# EAGLE design Orthrus_3_0_1 (EAGLE 7.6.0)

## Sheet 1 of 2
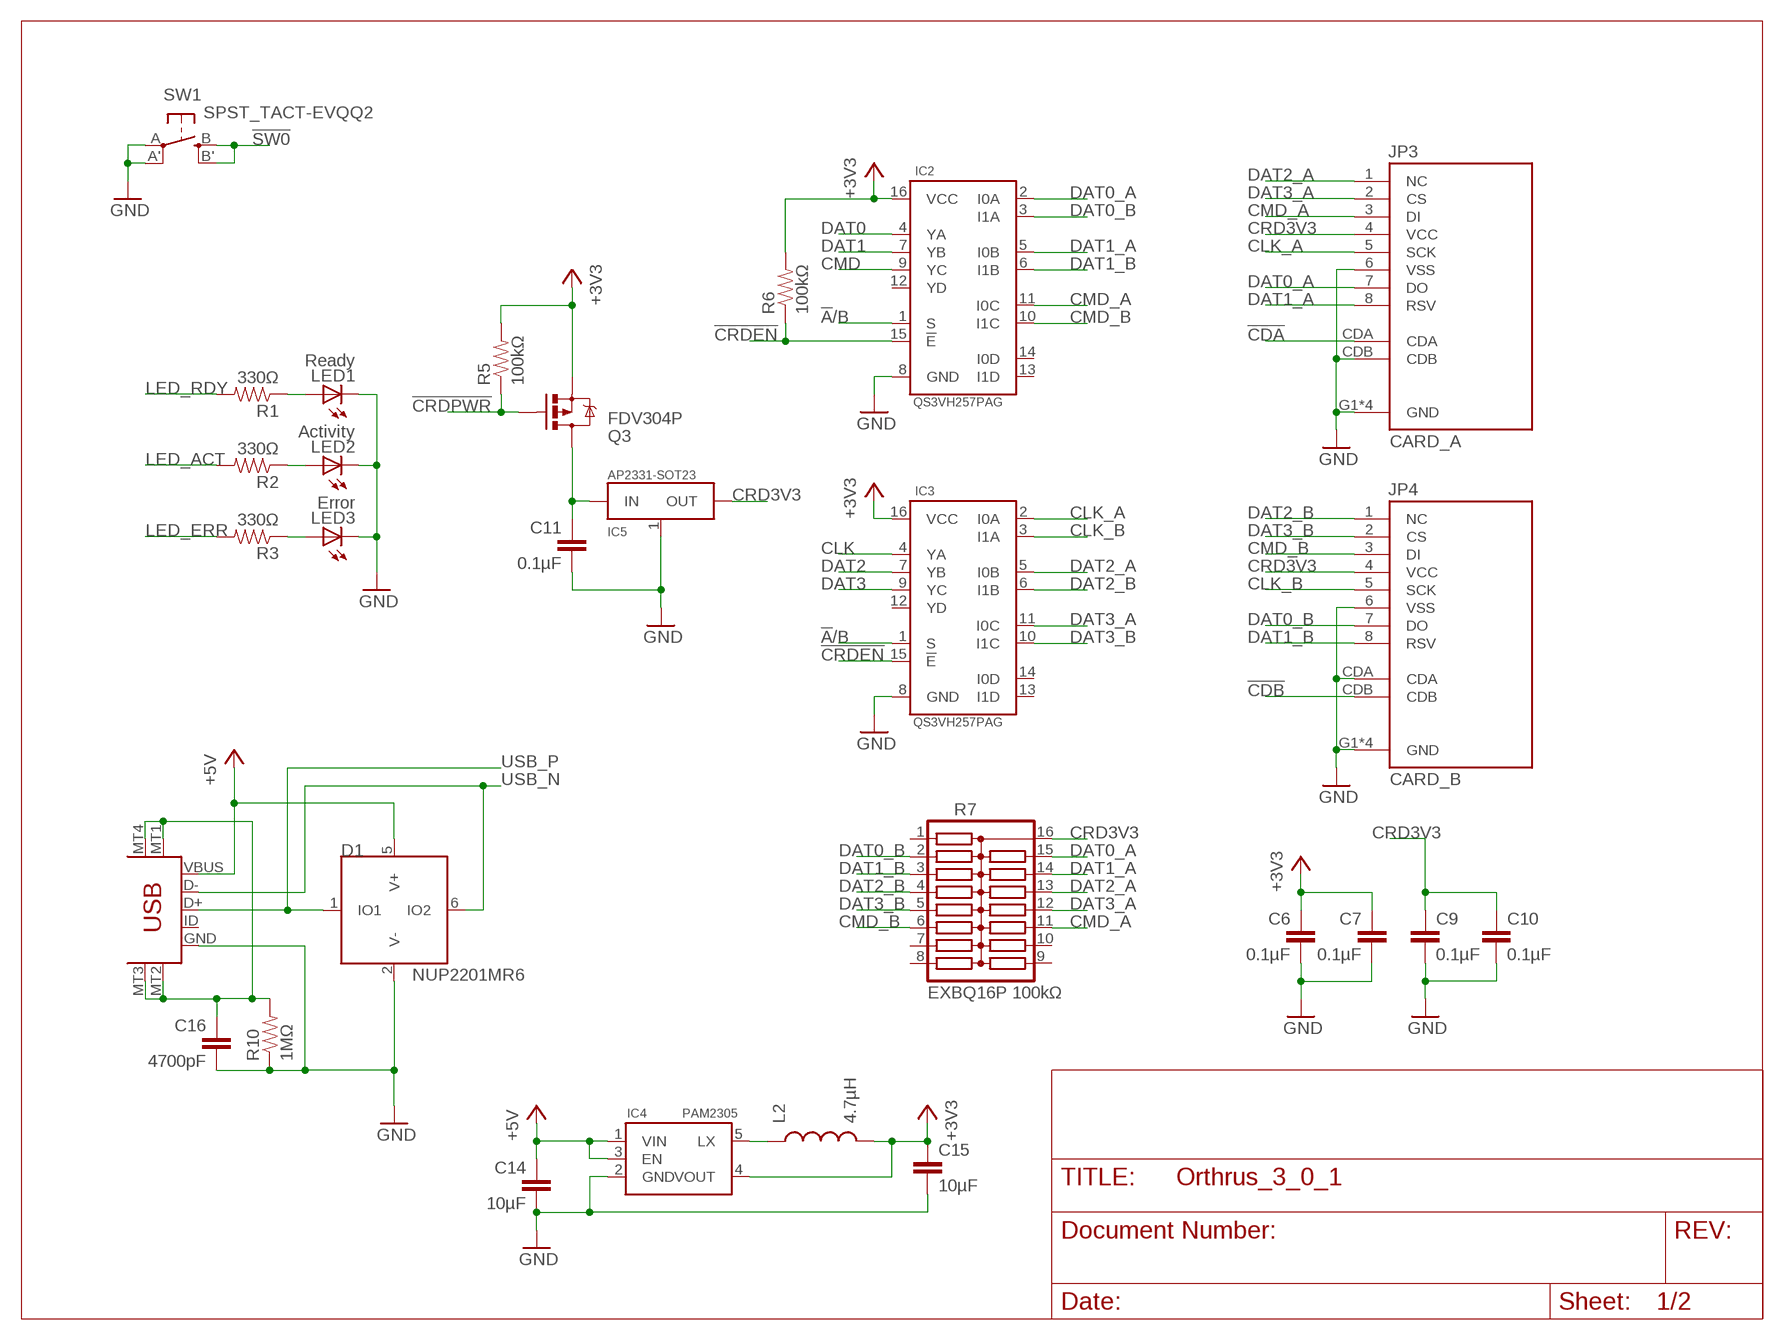
[diagram p0: schematic, sheet 1]

### Parts
C6  0.1µF  CAP0805  [0805]
C7  0.1µF  CAP0805  [0805]
C9  0.1µF  CAP0805  [0805]
C10  0.1µF  CAP0805  [0805]
C11  0.1µF  CAP0805  [0805]
C14  10µF  CAP0805  [0805]
C15  10µF  CAP0805  [0805]
C16  4700pF  CAP0805  [0805]
D1  NUP2201MR6  [SOT23-6]
IC2  QS3VH257PAG  [TSSOP16]
IC3  QS3VH257PAG  [TSSOP16]
IC4  PAM2305  SC189XSKTRTSC189XSKTRT  [SOT23-5]
IC5  AP2331-SOT23  [SOT23-3]
JP1  USB-5PIN-MICROB  [USB-MICROB]
JP3  CARD_A  DM3D-SF  [DM3D-SF]
JP4  CARD_B  DM3D-SF  [DM3D-SF]
L2  4.7µH  INDUCTOR0805  [0805]
LED1  Ready  LEDCHIP-LED0805  [CHIP-LED0805]
LED2  Activity  LEDCHIP-LED0805  [CHIP-LED0805]
LED3  Error  LEDCHIP-LED0805  [CHIP-LED0805]
Q3  FDV304P  MOSFET-PCHANNELSMD  [SOT23-3]
R1  330Ω  RESISTOR0805-RES  [0805]
R2  330Ω  RESISTOR0805-RES  [0805]
R3  330Ω  RESISTOR0805-RES  [0805]
R5  100kΩ  RESISTOR0805-RES  [0805]
R6  100kΩ  RESISTOR0805-RES  [0805]
R7  EXBQ16P 100kΩ  4816P-T02  [4816P]
R10  1MΩ  RESISTOR0805-RES  [0805]
SW1  SPST_TACT-EVQQ2  [EVQ-Q2]

### Nets
!A!/B: IC2.1(S) IC3.1(S) ; also sheet 2
!CDA: JP3.CDA ; also sheet 2
!CDB: JP4.CDB ; also sheet 2
!CRDEN: IC2.15(!E) IC3.15(!E) R6.1 ; also sheet 2
!CRDPWR: Q3.1(G) R5.1 ; also sheet 2
!SW0: SW1.B'(S1) SW1.B(S) ; also sheet 2
+3V3: C6.1 C7.1 C15.1 IC2.16(VCC) IC3.16(VCC) IC4.4(VOUT) L2.2 Q3.2(S) R5.2 R6.2 ; also sheet 2
+5V: C14.1 D1.5(V+) IC4.1(VIN) IC4.3(EN) JP1.VBUS
CLK: IC3.4(YA) ; also sheet 2
CLK_A: IC3.2(I0A) JP3.5(SCK)
CLK_B: IC3.3(I1A) JP4.5(SCK)
CMD: IC2.9(YC) ; also sheet 2
CMD_A: IC2.11(I0C) JP3.3(DI) R7.11
CMD_B: IC2.10(I1C) JP4.3(DI) R7.6
CRD3V3: C9.1 C10.1 IC5.2(OUT) JP3.4(VCC) JP4.4(VCC) R7.16
DAT0: IC2.4(YA) ; also sheet 2
DAT0_A: IC2.2(I0A) JP3.7(DO) R7.15
DAT0_B: IC2.3(I1A) JP4.7(DO) R7.2
DAT1: IC2.7(YB) ; also sheet 2
DAT1_A: IC2.5(I0B) JP3.8(RSV) R7.14
DAT1_B: IC2.6(I1B) JP4.8(RSV) R7.3
DAT2: IC3.7(YB) ; also sheet 2
DAT2_A: IC3.5(I0B) JP3.1(NC) R7.13
DAT2_B: IC3.6(I1B) JP4.1(NC) R7.4
DAT3: IC3.9(YC) ; also sheet 2
DAT3_A: IC3.11(I0C) JP3.2(CS) R7.12
DAT3_B: IC3.10(I1C) JP4.2(CS) R7.5
GND: C6.2 C7.2 C9.2 C10.2 C11.2 C14.2 C15.2 C16.2 D1.2(V-) IC2.8(GND) IC3.8(GND) IC4.2(GND) IC5.1(GND) JP1.GND JP3.6(VSS) JP3.CDB JP3.G1(GND) JP3.G2(GND) JP3.G3(GND) JP3.G4(GND) JP4.6(VSS) JP4.CDA JP4.G1(GND) JP4.G2(GND) JP4.G3(GND) JP4.G4(GND) LED1.C LED2.C LED3.C R10.1 SW1.A'(P1) SW1.A(P) ; also sheet 2
LED_ACT: R2.2 ; also sheet 2
LED_ERR: R3.2 ; also sheet 2
LED_RDY: R1.2 ; also sheet 2
N$1: IC4.5(LX) L2.1
N$2: C11.1 IC5.3(IN) Q3.3(D)
N$4: C16.1 JP1.MT1(MTN1) JP1.MT2(MTN3) JP1.MT3(MTN4) JP1.MT4(MTN2) R10.2
N$14: LED3.A R3.1
N$15: LED2.A R2.1
N$16: LED1.A R1.1
USB_N [diff pair]: D1.6(IO2) JP1.D- ; also sheet 2
USB_P [diff pair]: D1.1(IO1) JP1.D+ ; also sheet 2
Unconnected: IC2.12(YD) IC2.13(I1D) IC2.14(I0D) IC3.12(YD) IC3.13(I1D) IC3.14(I0D) JP1.ID R7.1 R7.7 R7.8 R7.9 R7.10

## Sheet 2 of 2
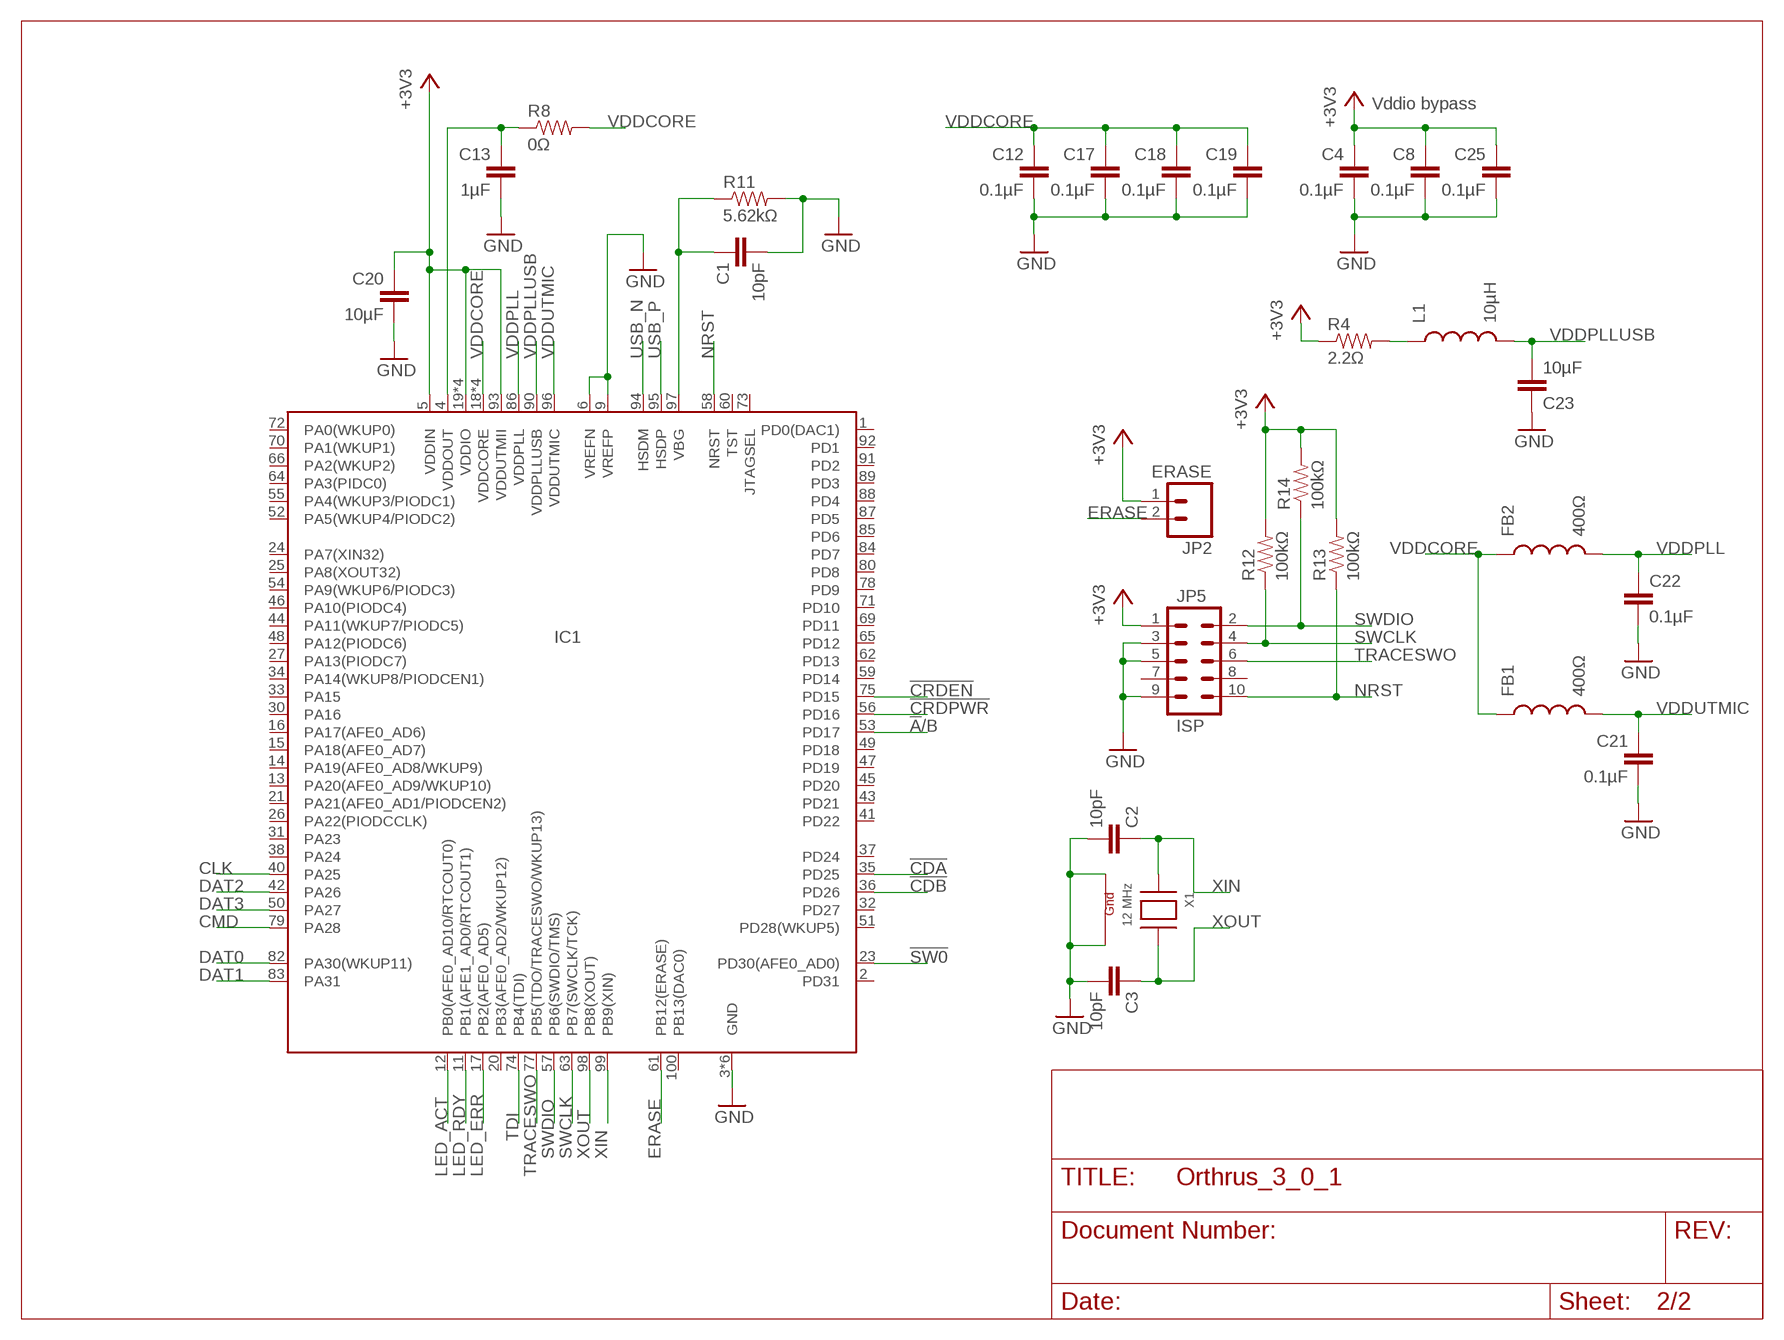
[diagram p1: schematic, sheet 2]

### Parts
C1  10pF  CAP0805  [0805]
C2  10pF  CAP0805  [0805]
C3  10pF  CAP0805  [0805]
C4  0.1µF  CAP0805  [0805]
C8  0.1µF  CAP0805  [0805]
C12  0.1µF  CAP0805  [0805]
C13  1µF  CAP0805  [0805]
C17  0.1µF  CAP0805  [0805]
C18  0.1µF  CAP0805  [0805]
C19  0.1µF  CAP0805  [0805]
C20  10µF  CAP0805  [0805]
C21  0.1µF  CAP0805  [0805]
C22  0.1µF  CAP0805  [0805]
C23  10µF  CAP0805  [0805]
C25  0.1µF  CAP0805  [0805]
FB1  400Ω  INDUCTOR0805  [0805]
FB2  400Ω  INDUCTOR0805  [0805]
IC1  ATSAMS70NXXAN  [TQFP100]
JP2  ERASE  M02PTH  [1X02]
JP5  ISP  M05X250MIL  [JTAGICE3-50MIL]
L1  10µH  INDUCTOR0805  [0805]
R4  2.2Ω  RESISTOR0805-RES  [0805]
R8  0Ω  RESISTOR0805-WITH-JUMPER  [0805-WITH-JUMPER]
R11  5.62kΩ  RESISTOR0805-RES  [0805]
R12  100kΩ  RESISTOR0805-RES  [0805]
R13  100kΩ  RESISTOR0805-RES  [0805]
R14  100kΩ  RESISTOR0805-RES  [0805]
X1  12 MHz  XTAL-4-3225  [NX3225]

### Nets
!A!/B: IC1.53(PD17) ; also sheet 1
!CDA: IC1.35(PD25) ; also sheet 1
!CDB: IC1.36(PD26) ; also sheet 1
!CRDEN: IC1.75(PD15) ; also sheet 1
!CRDPWR: IC1.56(PD16) ; also sheet 1
!SW0: IC1.23(PD30(AFE0_AD0)) ; also sheet 1
+3V3: C4.1 C8.1 C20.1 C25.1 IC1.5(VDDIN) IC1.19(VDDIO) IC1.28(VDDIO) IC1.68(VDDIO) IC1.81(VDDIO) IC1.93(VDDUTMII) JP2.1 JP5.1 R4.1 R12.2 R13.2 R14.2 ; also sheet 1
CLK: IC1.40(PA25) ; also sheet 1
CMD: IC1.79(PA28) ; also sheet 1
DAT0: IC1.82(PA30(WKUP11)) ; also sheet 1
DAT1: IC1.83(PA31) ; also sheet 1
DAT2: IC1.42(PA26) ; also sheet 1
DAT3: IC1.50(PA27) ; also sheet 1
ERASE: IC1.61(PB12(ERASE)) JP2.2
GND: C1.2 C2.2 C3.2 C4.2 C8.2 C12.2 C13.2 C17.2 C18.2 C19.2 C20.2 C21.2 C22.2 C23.1 C25.2 IC1.3(GND) IC1.6(VREFN) IC1.7(GND) IC1.8(GND) IC1.9(VREFP) IC1.10(GND) IC1.29(GND) IC1.67(GND) JP5.3 JP5.5 JP5.9 R11.2 X1.2(G2) X1.4(G1) ; also sheet 1
LED_ACT: IC1.12(PB0(AFE0_AD10/RTCOUT0)) ; also sheet 1
LED_ERR: IC1.17(PB2(AFE0_AD5)) ; also sheet 1
LED_RDY: IC1.11(PB1(AFE1_AD0/RTCOUT1)) ; also sheet 1
N$3: C1.1 IC1.97(VBG) R11.1
N$5: L1.1 R4.2
N$6: C13.1 IC1.4(VDDOUT) R8.1
NRST: IC1.58(NRST) JP5.10 R13.1
SWCLK: IC1.63(PB7(SWCLK/TCK)) JP5.4 R12.1
SWDIO: IC1.57(PB6(SWDIO/TMS)) JP5.2 R14.1
TDI: IC1.74(PB4(TDI))
TRACESWO: IC1.77(PB5(TDO/TRACESWO/WKUP13)) JP5.6
USB_N [diff pair]: IC1.94(HSDM) ; also sheet 1
USB_P [diff pair]: IC1.95(HSDP) ; also sheet 1
VDDCORE: C12.1 C17.1 C18.1 C19.1 FB1.1 FB2.1 IC1.18(VDDCORE) IC1.22(VDDCORE) IC1.39(VDDCORE) IC1.76(VDDCORE) R8.2
VDDPLL: C22.1 FB2.2 IC1.86(VDDPLL)
VDDPLLUSB: C23.2 IC1.90(VDDPLLUSB) L1.2
VDDUTMIC: C21.1 FB1.2 IC1.96(VDDUTMIC)
XIN: C2.1 IC1.99(PB9(XIN)) X1.1(X1)
XOUT: C3.1 IC1.98(PB8(XOUT)) X1.3(X2)
Unconnected: IC1.1(PD0(DAC1)) IC1.2(PD31) IC1.13(PA20(AFE0_AD9/WKUP10)) IC1.14(PA19(AFE0_AD8/WKUP9)) IC1.15(PA18(AFE0_AD7)) IC1.16(PA17(AFE0_AD6)) IC1.20(PB3(AFE0_AD2/WKUP12)) IC1.21(PA21(AFE0_AD1/PIODCEN2)) IC1.24(PA7(XIN32)) IC1.25(PA8(XOUT32)) IC1.26(PA22(PIODCCLK)) IC1.27(PA13(PIODC7)) IC1.30(PA16) IC1.31(PA23) IC1.32(PD27) IC1.33(PA15) IC1.34(PA14(WKUP8/PIODCEN1)) IC1.37(PD24) IC1.38(PA24) IC1.41(PD22) IC1.43(PD21) IC1.44(PA11(WKUP7/PIODC5)) IC1.45(PD20) IC1.46(PA10(PIODC4)) IC1.47(PD19) IC1.48(PA12(PIODC6)) IC1.49(PD18) IC1.51(PD28(WKUP5)) IC1.52(PA5(WKUP4/PIODC2)) IC1.54(PA9(WKUP6/PIODC3)) IC1.55(PA4(WKUP3/PIODC1)) IC1.59(PD14) IC1.60(TST) IC1.62(PD13) IC1.64(PA3(PIDC0)) IC1.65(PD12) IC1.66(PA2(WKUP2)) IC1.69(PD11) IC1.70(PA1(WKUP1)) IC1.71(PD10) IC1.72(PA0(WKUP0)) IC1.73(JTAGSEL) IC1.78(PD9) IC1.80(PD8) IC1.84(PD7) IC1.85(PD6) IC1.87(PD5) IC1.88(PD4) IC1.89(PD3) IC1.91(PD2) IC1.92(PD1) IC1.100(PB13(DAC0)) JP5.7 JP5.8

### Notes on the sheet
- Vddio bypass

## Library data of the parts
C1-C4 C6-C23 C25 = SparkFun-Capacitors:CAP: Capacitor Standard 0603 ceramic capacitor, and 0.1" leaded capacitor.
D1 = AP2331:NUP2201MR6
FB1 FB2 L1 L2 = SparkFun-Passives:INDUCTOR: Inductors Basic Inductor/Choke - 0603 and 1206. Footprints are not proven and vary greatly between part numbers. SRN6045- 33uH, 20% 1.4A
IC1 = avr-7:ATSAMS70NXX
IC2 IC3 = AP2331:QS3VH257
IC4 = regulators:SC189XSKTRT
IC5 = AP2331:AP2331-SOT23
JP1 = SparkFun-Connectors:USB-5PIN: Mini-USB "B" connector with 5th pin broken out. Created new symbol breaking out 5th "ID" pin in mini/micro USB connector spec. See: http://en.wikipedia.org/wiki/Mini_usb#Cables. Uses same footprint as 4-pin symbol. Also added pins to connect to mounting / shield pads if required (probably not generally needed as signals aren't shielded once they leave the connector).
JP2 = SparkFun-Connectors:M02: Standard 2-pin 0.1" header. Use with - straight break away headers ( PRT-00116) - right angle break away headers (PRT-00553) - swiss pins (PRT-00743) - machine pins (PRT-00117) - female headers (PRT-00115) Molex polarized connector foot print use with: PRT-08233 with associated crimp pins and housings. 2.54_SCREWTERM for use with PRT-10571. 3.5mm Screw Terminal footprints for PRT-08084 5mm Screw Terminal footprints for use with PRT-08433
JP3 JP4 = hirose_usd:DM3D-SF
JP5 = SparkFun-Connectors-new:M05X2: Header 5x2 Standard 10-pin dual row 0.1" header. Commonly used with AVR-ISP. Use with Spark Fun Electronics SKU: PRT-00778
LED1-LED3 = adafruit:LED: LED OSRAM: - CHIPLED LG R971, LG N971, LY N971, LG Q971, LY Q971, LO R971, LY R971 LH N974, LH R974 LS Q976, LO Q976, LY Q976 LO Q996 - Hyper CHIPLED LW Q18S LB Q993, LB Q99A, LB R99A - SideLED LS A670, LO A670, LY A670, LG A670, LP A670 LB A673, LV A673, LT A673, LW A673 LH A674 LY A675 LS A676, LA A676, LO A676, LY A676, LW A676 LS A679, LY A679, LG A679 - Hyper Micro SIDELED® LS Y876, LA Y876, LO Y876, LY Y876 LT Y87S - SmartLED LW L88C, LW L88S LB L89C, LB L89S, LG L890 LS L89K, LO L89K, LY L89K LS L896, LA L896, LO L896, LY L896 - TOPLED LS T670, LO T670, LY T670, LG T670, LP T670 LSG T670, LSP T670, LSY T670, LOP T670, LYG T670 LG T671, LOG T671, LSG T671 LB T673, LV T673, LT T673, LW T673 LH T674 LS T676, LA T676, LO T676, LY T676, LB T676, LH T676, LSB T676, LW T676 LB T67C, LV T67C, LT T67C, LS T67K, LO T67K, LY T67K, LW E67C LS E67B, LA E67B, LO E67B, LY E67B, LB E67C, LV E67C, LT E67C LW T67C LS T679, LY T679, LG T679 LS T770, LO T770, LY T770, LG T770, LP T770 LB T773, LV T773, LT T773, LW T773 LH T774 LS E675, LA E675, LY E675, LS T675 LS T776, LA T776, LO T776, LY T776, LB T776 LHGB T686 LT T68C, LB T68C - Hyper Mini TOPLED® LB M676 - Mini TOPLED Santana® LG M470 LS M47K, LO M47K, LY M47K Source: http://www.osram.convergy.de/
Q3 = SparkFun-DiscreteSemi:MOSFET-PCHANNEL: Generic PMOSFET
R1-R6 R8 R10-R14 = SparkFun-Resistors:RESISTOR: Resistor Basic schematic elements and footprints for 0603, 1206, and PTH resistors.
R7 = resistor-bourns copy:4816P-T02: BOURNS RESISTOR NETWORK; MF: BOURNS, INC.; MPN: 4816P-T02-824LF; OC_FARNELL: 9357599; OC_NEWARK: 33K0777
SW1 = adafruit:SPST_TACT: SMT 6mm switch, EVQQ2 series http://www.ladyada.net/library/eagle
X1 = adafruit:XTAL-4: Classic 4-pin 3.2 x 2.5mm crystal

## Net classes
1 diff pair: width 0.152 mm, drill 0.33 mm

## Board
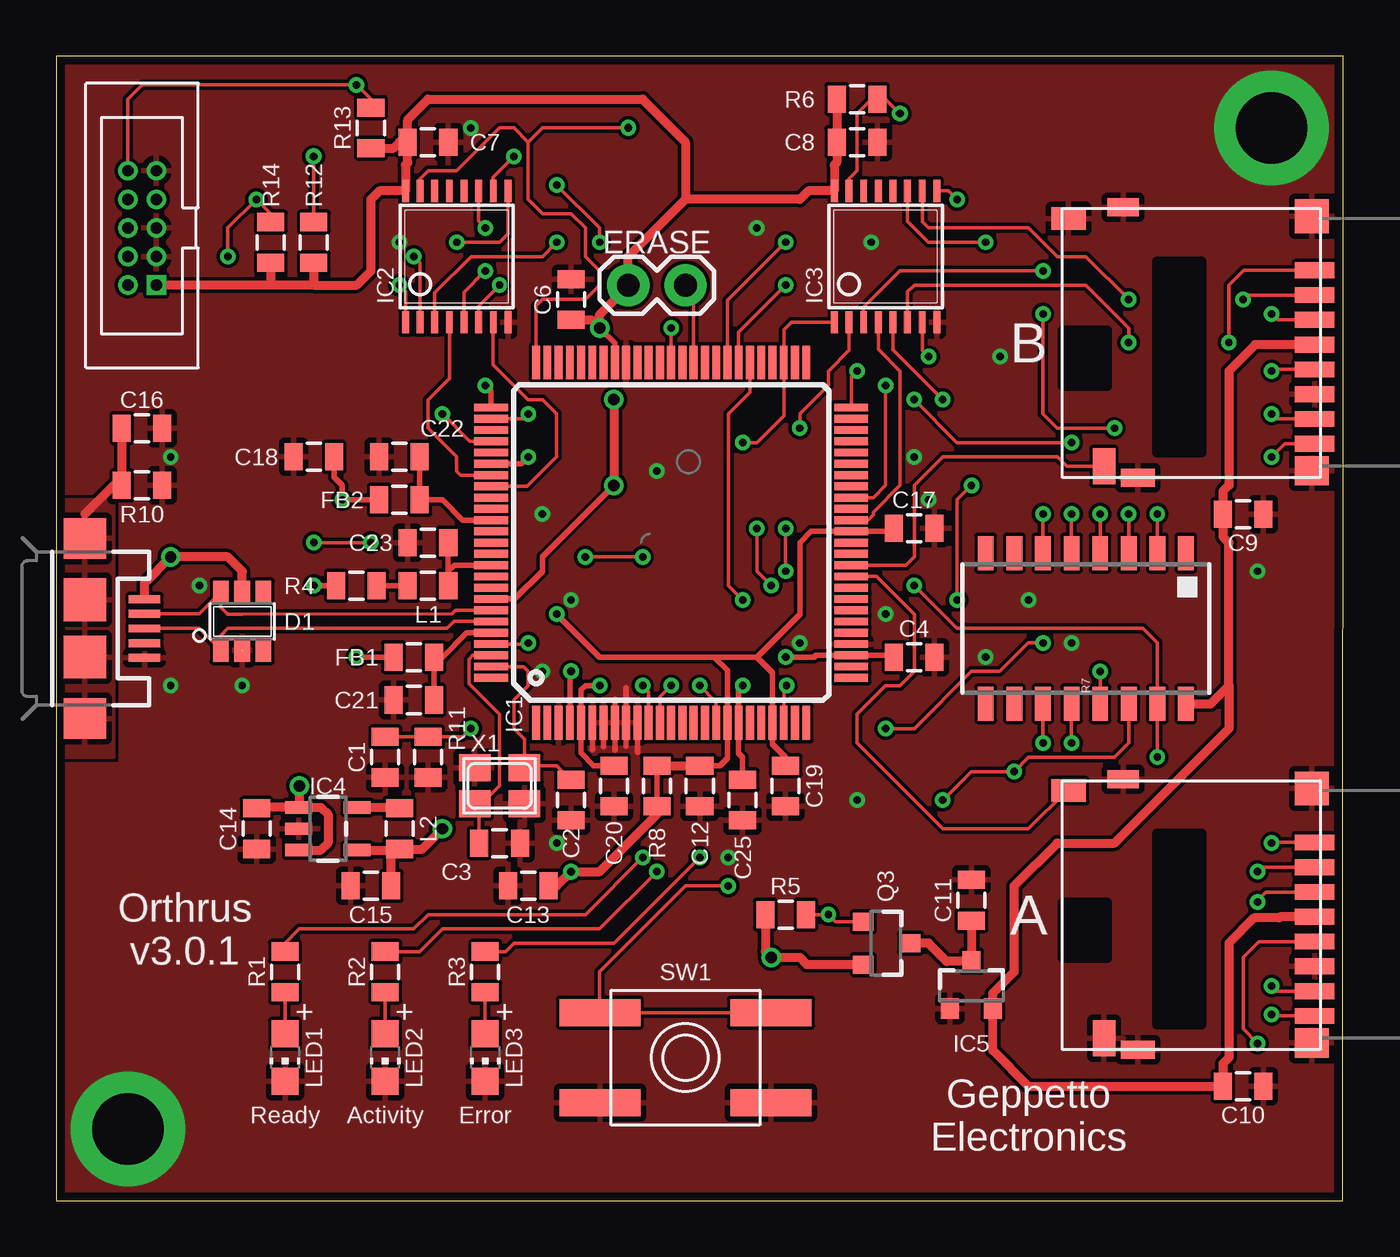
[diagram p2: board, top side]
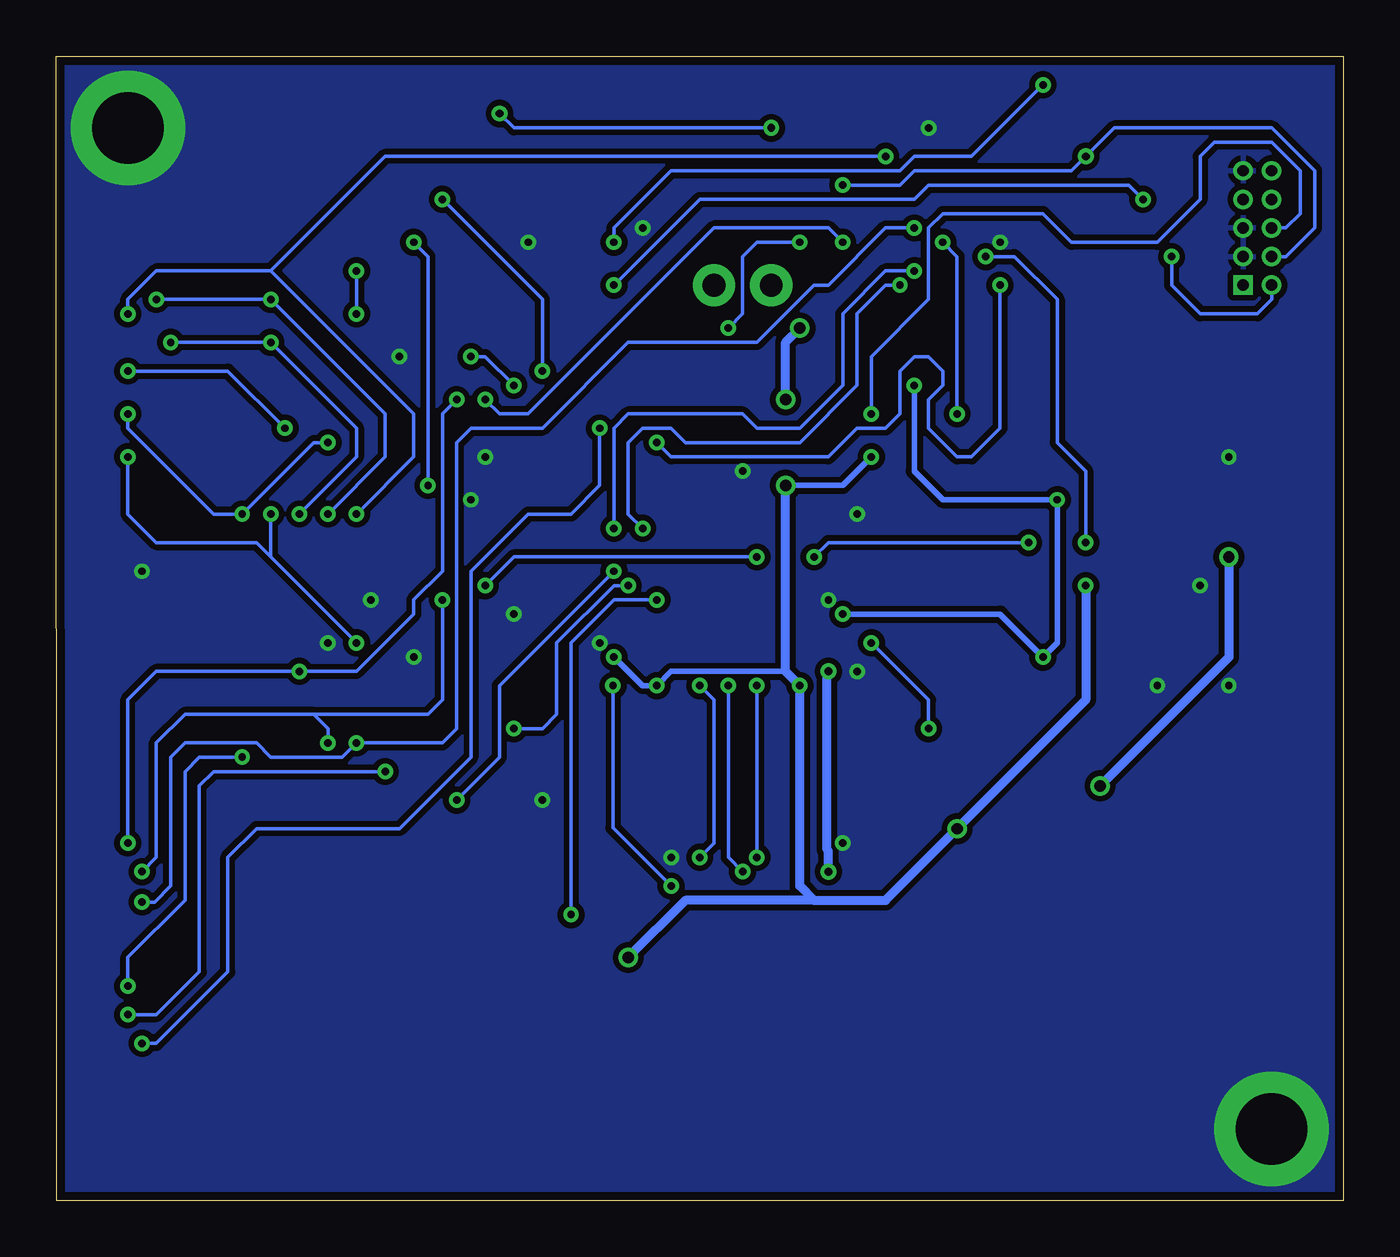
[diagram p3: board, bottom side, seen from below]

Size 57.15 x 50.8 mm. Coordinates in mm from the lower left corner, seen from the top.
Outline: 0,0 57.13,0 57.15,50.8 0,50.8 0,0
Copper layers (1*16): Top 0.0356mm / dielectric 1.5011mm / Bottom 0.0356mm
Design rules "oshpark-2layer *": minimum track width 6mil, minimum drill 13mil, track to track 6mil, track to pad 6mil, pad to pad 6mil, via to via 6mil, smd to smd 6mil, copper to edge 15mil, drill to drill 6mil, minimum pad ring 7mil, minimum via ring 7mil, stop-mask expansion 2.5mil, vias tented up to drill 20mil, thermal gap 10mil

### Footprints (pad centres in the part's own frame; a part is rotated, then mirrored left to right if it is on the bottom)
0805 = smd 0.8 x 1.2: 1 -0.9,0; 2 0.9,0
SOT23-6 = smd 0.69 x 0.99: 1 -0.95,-1.29; 2 0,-1.29; 3 0.95,-1.29; 4 0.95,1.3; 5 0,1.3; 6 -0.95,1.3
TQFP100 = smd 1.5 x 0.35: 1 -8,6; 2 -8,5.5; 3 -8,5; 4 -8,4.5; 5 -8,4; 6 -8,3.5; 7 -8,3; 8 -8,2.5; 9 -8,2; 10 -8,1.5; 11 -8,1; 12 -8,0.5; 13 -8,0; 14 -8,-0.5; 15 -8,-1; 16 -8,-1.5; 17 -8,-2; 18 -8,-2.5; 19 -8,-3; 20 -8,-3.5; 21 -8,-4; 22 -8,-4.5; 23 -8,-5; 24 -8,-5.5; 25 -8,-6; 51 8,-6; 52 8,-5.5; 53 8,-5; 54 8,-4.5; 55 8,-4; 56 8,-3.5; 57 8,-3; 58 8,-2.5; 59 8,-2; 60 8,-1.5; 61 8,-1; 62 8,-0.5; 63 8,0; 64 8,0.5; 65 8,1; 66 8,1.5; 67 8,2; 68 8,2.5; 69 8,3; 70 8,3.5; 71 8,4; 72 8,4.5; 73 8,5; 74 8,5.5; 75 8,6 | smd 0.35 x 1.5: 26 -6,-8; 27 -5.5,-8; 28 -5,-8; 29 -4.5,-8; 30 -4,-8; 31 -3.5,-8; 32 -3,-8; 33 -2.5,-8; 34 -2,-8; 35 -1.5,-8; 36 -1,-8; 37 -0.5,-8; 38 0,-8; 39 0.5,-8; 40 1,-8; 41 1.5,-8; 42 2,-8; 43 2.5,-8; 44 3,-8; 45 3.5,-8; 46 4,-8; 47 4.5,-8; 48 5,-8; 49 5.5,-8; 50 6,-8; 76 6,8; 77 5.5,8; 78 5,8; 79 4.5,8; 80 4,8; 81 3.5,8; 82 3,8; 83 2.5,8; 84 2,8; 85 1.5,8; 86 1,8; 87 0.5,8; 88 0,8; 89 -0.5,8; 90 -1,8; 91 -1.5,8; 92 -2,8; 93 -2.5,8; 94 -3,8; 95 -3.5,8; 96 -4,8; 97 -4.5,8; 98 -5,8; 99 -5.5,8; 100 -6,8
TSSOP16 = smd 0.305 x 0.991: 1 -2.275,-2.918; 2 -1.625,-2.918; 3 -0.975,-2.918; 4 -0.325,-2.918; 5 0.325,-2.918; 6 0.975,-2.918; 7 1.625,-2.918; 8 2.275,-2.918; 9 2.275,2.918; 10 1.625,2.918; 11 0.975,2.918; 12 0.325,2.918; 13 -0.325,2.918; 14 -0.975,2.918; 15 -1.625,2.918; 16 -2.275,2.918
SOT23-5 = smd 0.55 x 1.2: 1 -0.95,-1.3; 2 0,-1.3; 3 0.95,-1.3; 4 0.95,1.3; 5 -0.95,1.3
SOT23-3 = smd 0.8 x 0.9: 1 -0.95,-1; 2 0.95,-1; 3 0,1.1
USB-MICROB = smd 0.35 x 1.4: D+ 0,2.65; D- -0.65,2.65; GND 1.3,2.65; ID 0.65,2.65; VBUS -1.3,2.65 | smd 1.8 x 1.9: MT1 -4,0; MT4 4,0 | smd 1.9 x 1.9: MT2 -1.27,0; MT3 1.27,0
1X02 = drill 1.016 pad 1.88: 1 0,0; 2 2.54,0
DM3D-SF = smd 0.7 x 1.75: 1 3.2,0; 2 2.1,0; 3 1,0; 4 -0.1,0; 5 -1.2,0; 6 -2.3,0; 7 -3.4,0; 8 -4.5,0 | smd 1 x 1.55: CDA 5.5,10.925 | smd 1.6 x 1: CDB -5.5,9.35 | smd 1.3 x 1.5: G1 -5.7,0.125 | smd 1.5 x 1.5: G2 5.6,0.125 | smd 0.8 x 1.5: G3 -6,7.85 | smd 0.8 x 1.4: G4 6,8.5
JTAGICE3-50MIL = drill 0.508 pad 0.813 square: 1 -2.54,-0.635 | drill 0.508 pad 0.813: 2 -2.54,0.635; 3 -1.27,-0.635; 4 -1.27,0.635; 5 0,-0.635; 6 0,0.635; 7 1.27,-0.635; 8 1.27,0.635; 9 2.54,-0.635; 10 2.54,0.635
CHIP-LED0805 = smd 1.2 x 1.2: A 0,-1.05; C 0,1.05
4816P = smd 0.7 x 1.5: 1 -4.445,-3.346; 2 -3.175,-3.346; 3 -1.905,-3.346; 4 -0.635,-3.346; 5 0.635,-3.346; 6 1.905,-3.346; 7 3.175,-3.346; 8 4.445,-3.346; 9 4.445,3.346; 10 3.175,3.346; 11 1.905,3.346; 12 0.635,3.346; 13 -0.635,3.346; 14 -1.905,3.346; 15 -3.175,3.346; 16 -4.445,3.346
0805-WITH-JUMPER = smd 0.8 x 1.2: 1 -0.9,0; 2 0.9,0
EVQ-Q2 = smd 3.6 x 1.2: A -3.8,-2; A' 3.8,-2; B -3.8,2; B' 3.8,2
NX3225 = smd 1.4 x 1.2: 1 -1.1,-0.8; 2 1.1,-0.8; 3 1.1,0.8; 4 -1.1,0.8

### Placement (x,y rotation side)
C1  14.61,19.68 270 top
C2  22.86,17.78 270 top
C3  19.68,15.88 0 top
C4  38.1,24.13 0 top
C6  22.86,40.01 90 top
C7  16.51,46.99 0 top
C8  35.56,46.99 0 top
C9  52.7,30.48 0 top
C10  52.7,5.08 0 top
C11  40.64,13.34 90 top
C12  28.57,18.41 270 top
C13  20.95,13.97 180 top
C14  8.89,16.51 270 top
C15  13.97,13.97 180 top
C16  3.81,34.29 0 top
C17  38.1,29.84 0 top
C18  11.43,33.02 180 top
C19  32.38,18.41 270 top
C20  24.77,18.41 270 top
C21  15.88,22.23 180 top
C22  15.24,33.02 180 top
C23  16.51,29.21 0 top
C25  30.48,17.78 270 top
D1  8.26,25.72 0 top
FB1  15.88,24.13 0 top
FB2  15.24,31.11 0 top
IC1  27.3,29.21 90 top
IC2  17.78,41.91 0 top
IC3  36.83,41.91 0 top
IC4  12.06,16.51 270 top
IC5  40.64,9.53 0 top
JP1  1.27,25.4 270 top
JP2  25.4,40.64 0 top
JP3  55.88,12.7 90 top
JP4  55.88,38.1 90 top
JP5  3.81,43.18 90 top
L1  16.51,27.3 0 top
L2  15.24,16.51 270 top
LED1  10.16,6.35 180 top
LED2  14.61,6.35 180 top
LED3  19.05,6.35 180 top
Q3  36.83,11.43 270 top
R1  10.16,10.16 90 top
R2  14.61,10.16 90 top
R3  19.05,10.16 90 top
R4  13.34,27.3 0 top
R5  32.38,12.7 180 top
R6  35.56,48.9 180 top
R7  45.72,25.4 180 top
R8  26.67,18.41 90 top
R10  3.81,31.75 180 top
R11  16.51,19.68 270 top
R12  11.43,42.55 270 top
R13  13.97,47.62 270 top
R14  9.53,42.55 270 top
SW1  27.94,6.35 0 top
X1  19.68,18.41 180 top

### Tracks (layer width: path | path; a pad name or v marks a point on that pad's centre or on a via)
!A!/B  (via drill 0.33)
  Top 0.152: IC3.1 32.64,38.99 32.3,38.66 IC1.53 32.3,34.84 31.11,33.66 v30.48,33.66 | IC2.1 15.51,40.38 v15.24,40.64
  Bottom 0.152: v15.24,40.64 15.24,34.29 16.51,33.02 17.14,33.02 18.41,34.29 18.41,35.56 17.78,36.2 17.78,36.83 18.41,37.47 19.05,37.47 19.68,36.83 19.68,34.92 20.32,34.29 21.59,34.29 22.86,33.02 29.84,33.02 v30.48,33.66
!CDA
  Top 0.152: JP3.CDA 44.87,18.2 43.18,16.51 39.37,16.51 35.56,20.32 35.56,21.59 36.83,22.86 37.47,22.86 38.1,23.5 38.1,26.04 36.42,27.71 IC1.35
!CDB
  Top 0.152: JP4.CDB 44.87,32.6 44.45,33.02 39.37,33.02 38.1,31.75 38.1,28.57 37.73,28.21 IC1.36
!CRDEN  (via drill 0.35)
  Top 0.152: IC3.15 35.2,45.37 35.56,45.72 35.56,48.26 36.2,48.9 R6.1 36.83,48.9 v37.47,48.26 | 20.95,46.99 20.95,44.45 21.59,43.81 22.86,43.81 23.5,43.18 23.5,41.91 24.13,41.27 24.13,40.64 23.5,40.01 21.59,40.01 21.3,39.72 IC1.75 | 20.95,46.99 20.32,47.62 19.68,47.62 17.78,45.72 16.51,45.72 16.16,45.37 IC2.15 | 20.95,46.99 21.59,47.62 v25.4,47.62
  Bottom 0.152: v25.4,47.62 36.83,47.62 v37.47,48.26
!CRDPWR  (via drill 0.33)
  Top 0.152: IC1.56 30.8,35.88 29.84,34.92 29.84,27.3 30.17,27 v30.48,26.67 | Q3.1 34.61,12.38 v34.29,12.7 R5.1
  Bottom 0.152: v30.48,26.67 32.38,26.67 34.29,24.77 v34.29,12.7
!SW0  (via drill 0.33)
  Top 0.152: SW1.B' SW1.B 24.13,10.16 27.94,13.97 v29.84,13.97 | IC1.23 32.3,22.78 32.38,22.86 v32.43,22.86
  Bottom 0.152: v32.43,22.86 32.43,16.55 v29.84,13.97
+3V3  (via drill 0.33, 0.51)
  Top 0.254: C4.1 37.12,24.21 IC1.28 33.73,24.21 33.66,24.13 v32.38,24.13 | C20.1 23.86,19.32 23.3,19.88 IC1.5 23.3,22.67 23.5,22.86 v24.13,22.86 | v30.48,22.86 30.3,22.68 IC1.19 30.3,19.86 30.48,19.68 C25.1 | R4.1 v11.43,27.3 | IC1.93 20.36,26.71 21.59,27.94 21.59,28.57 v24.77,31.75 | IC1.81 20.64,32.71 v20.95,33.02 | IC1.68 24.8,38.06 v24.13,38.73
  Top 0.406: IC4.4 15.19,15.56 L2.2 | C15.1 14.87,15.24 L2.2 | L2.2 16.25,15.61 v17.14,16.51 | Q3.2 33.34,10.48 33.02,10.79 v31.75,10.79 31.48,11.06 R5.2 | C7.1 15.61,46.09 15.51,45.98 IC2.16 14.35,44.83 13.97,44.45 13.97,41.27 13.34,40.64 11.43,40.64 | R13.2 14.97,46.73 15.24,46.99 C7.1 | 27.94,44.45 25.4,41.91 JP2.1 24.8,40.05 24.8,40.01 24.13,39.33 v24.13,38.73 23.76,39.1 C6.1 | 27.94,44.45 33.02,44.45 33.4,44.83 IC3.16 34.55,45.98 34.66,46.09 C8.1 R6.2 | C7.1 15.61,47.99 16.51,48.9 26.04,48.9 27.94,46.99 27.94,44.45 | 9.53,40.64 JP5.1 | 11.43,40.64 9.53,40.64 | v24.77,35.56 v24.77,31.75 | R14.2 9.53,40.64 | R12.2 11.43,40.64
  Bottom 0.254: v32.38,24.13 31.11,22.86 v30.48,22.86 29.84,23.5 24.77,23.5 | v24.77,31.75 22.23,31.75 v20.95,33.02
  Bottom 0.406: 23.5,13.34 20.32,13.34 v17.14,16.51 11.43,22.23 v11.43,27.3 | 23.5,13.34 29.21,13.34 v31.75,10.79 | 23.5,13.34 24.13,13.97 v24.13,22.86 24.77,23.5 v24.77,31.75 | v24.77,35.56 24.77,38.1 v24.13,38.73
+5V  (via drill 0.51)
  Top 0.406: IC4.1 8.94,17.46 C14.1 | IC4.3 11.75,15.56 12.06,15.88 12.06,17.14 11.75,17.46 IC4.1 | v10.79,18.41 10.79,17.49 IC4.1 | JP1.VBUS 3.92,27.41 v5.08,28.57 7.62,28.57 8.26,27.94 D1.5
  Bottom 0.406: v5.08,28.57 5.08,24.13 v10.79,18.41
CLK
  Top 0.152: IC1.40 36.05,30.21 36.28,30.44 36.28,30.57 37.47,31.75 37.47,36.83 36.51,37.79 IC3.4
CLK_A  (via drill 0.33)
  Top 0.152: JP3.5 53.41,11.5 52.7,10.79 52.7,7.62 v53.34,6.99 | IC3.2 35.2,37.74 34.29,36.83 34.29,36.2 33.02,34.92 v33.02,34.29
  Bottom 0.152: v53.34,6.99 52.7,6.99 49.53,10.16 49.53,15.24 48.26,16.51 41.91,16.51 38.73,19.68 38.73,27.94 36.2,30.48 34.29,30.48 33.02,31.75 v33.02,34.29
CLK_B  (via drill 0.33)
  Top 0.152: JP4.5 54.05,36.9 v53.98,36.83 | v46.99,34.29 44.45,34.29 43.81,34.92 v43.81,39.37 | IC3.3 35.85,39.66 37.47,41.27 v43.81,41.27
  Bottom 0.152: v53.98,36.83 49.53,36.83 v46.99,34.29 | v43.81,41.27 v43.81,39.37
CMD  (via drill 0.33)
  Top 0.152: IC1.79 18.36,33.71 v17.14,34.92 | IC2.9 20.05,42.91 19.68,42.55 v17.78,42.55
  Bottom 0.152: v17.78,42.55 17.14,41.91 v17.14,34.92
CMD_A  (via drill 0.33)
  Top 0.152: JP3.3 53.7,13.7 53.34,13.34 v53.34,13.26 | IC2.11 18.75,43.48 v19.05,43.18 | R7.11 v43.81,20.32
  Bottom 0.152: v53.34,13.26 52.78,13.26 52.07,13.97 52.07,19.68 51.44,20.32 48.26,20.32 47.62,19.68 44.45,19.68 v43.81,20.32 40.01,20.32 39.37,20.95 39.37,33.66 38.73,34.29 35.56,34.29 31.75,38.1 26.04,38.1 23.5,40.64 22.86,40.64 20.32,43.18 v19.05,43.18
CMD_B  (via drill 0.33)
  Top 0.152: JP4.3 54.24,39.1 v53.98,39.37 | IC2.10 19.41,45.44 v20.32,46.35 | v43.81,30.48 R7.6
  Bottom 0.152: v53.98,39.37 53.98,40.01 52.7,41.27 47.62,41.27 | 47.62,41.27 41.27,34.92 41.27,33.02 v43.81,30.48 | v20.32,46.35 42.55,46.35 47.62,41.27
CRD3V3
  Top 0.406: JP3.4 54.35,12.6 54.3,12.55 53.19,12.55 52.07,11.43 52.07,6.35 51.8,6.08 C10.1 43.18,5.08 41.59,6.67 IC5.2 41.59,9.21 42.55,10.16 42.55,13.97 44.45,15.88 46.99,15.88 52.07,20.95 52.07,22.86 | JP4.4 53.24,38 52.07,36.83 52.07,31.75 51.8,31.48 C9.1 51.8,29.48 52.07,29.21 52.07,22.86 | R7.16 51.26,22.05 52.07,22.86
DAT0
  Top 0.152: IC2.4 17.45,36.51 16.51,35.56 16.51,34.29 17.78,33.02 17.78,32.38 17.95,32.21 IC1.82
DAT0_A  (via drill 0.33)
  Top 0.152: JP3.7 54.2,9.3 v53.98,9.53 | IC2.2 16.16,41.63 v15.88,41.91 | v11.43,29.21 v13.97,29.21 | v23.5,28.57 v26.04,28.57 | v38.1,27.3 40.01,25.4 48.26,25.4 48.9,24.77 R7.15 v48.9,19.68
  Bottom 0.152: v53.98,9.53 53.98,10.79 51.44,13.34 51.44,19.05 50.8,19.68 v48.9,19.68 | v15.88,41.91 14.61,41.91 12.7,40.01 12.7,33.66 11.43,32.38 v11.43,29.21 | v13.97,29.21 22.86,29.21 v23.5,28.57 | v26.04,28.57 36.83,28.57 v38.1,27.3
DAT0_B  (via drill 0.33)
  Top 0.152: JP4.7 54.2,34.7 v53.98,34.92 | IC2.3 16.8,40.3 18.41,41.91 21.59,41.91 v22.23,42.55 | v45.09,33.66 40.01,33.66 v38.1,35.56 | v48.9,30.48 R7.2
  Bottom 0.152: v53.98,34.92 53.98,34.29 50.16,30.48 v48.9,30.48 45.72,33.66 v45.09,33.66 | v38.1,35.56 37.47,34.92 36.2,34.92 27.94,43.18 22.86,43.18 v22.23,42.55
DAT1
  Top 0.152: IC1.83 20.91,31.71 22.23,33.02 22.23,34.92 21.59,35.56 20.95,35.56 19.41,37.11 IC2.7
DAT1_A  (via drill 0.33)
  Top 0.152: JP3.8 54.03,8.2 v53.98,8.26 | IC2.5 18.11,40.33 v19.05,41.27 | v39.37,17.78 40.64,19.05 v42.55,19.05 43.18,19.68 46.99,19.68 47.62,20.32 R7.14 | v32.38,27.94 v32.38,29.84
  Bottom 0.152: v53.98,8.26 52.7,8.26 50.8,10.16 50.8,18.41 50.16,19.05 v42.55,19.05 | v19.05,41.27 20.32,41.27 22.23,39.37 22.23,36.2 24.13,34.29 26.04,34.29 26.67,34.92 31.75,34.92 32.38,34.29 v32.38,29.84 | v39.37,17.78 37.47,19.68 37.47,22.86 v32.38,27.94
DAT1_B  (via drill 0.33)
  Top 0.152: JP4.8 54.55,33.6 v53.98,33.02 | IC2.6 18.75,39.71 v19.68,40.64 | v31.11,29.84 31.11,27.94 v31.75,27.3 | v36.83,20.95 38.1,20.95 40.64,23.5 41.91,23.5 43.18,24.77 v43.81,24.77 | v47.62,30.48 R7.3
  Bottom 0.152: v53.98,33.02 53.98,30.48 52.7,29.21 48.26,29.21 47.62,28.57 | v19.68,40.64 20.32,40.64 21.59,39.37 21.59,36.2 24.13,33.66 29.21,33.66 29.84,34.29 31.11,34.29 31.75,33.66 31.75,30.48 v31.11,29.84 | v31.75,27.3 32.38,27.3 34.92,24.77 34.92,21.59 35.56,20.95 v36.83,20.95 | 47.62,28.57 v43.81,24.77 | 47.62,28.57 v47.62,30.48
DAT2  (via drill 0.33)
  Top 0.152: IC1.42 36.29,31.21 36.83,31.75 v36.83,36.2 | IC3.7 38.45,37.74 v38.73,37.47
  Bottom 0.152: v38.73,37.47 38.1,37.47 v36.83,36.2
DAT2_A  (via drill 0.33)
  Top 0.152: JP3.1 54,15.9 v53.98,15.88 | IC3.5 37.16,37.77 v39.37,35.56 | v46.35,23.5 R7.13
  Bottom 0.152: v53.98,15.88 53.98,22.23 52.7,23.5 v46.35,23.5 45.72,23.5 43.81,23.5 41.27,26.04 41.27,26.67 40.01,27.94 40.01,34.92 v39.37,35.56
DAT2_B  (via drill 0.33)
  Top 0.152: JP4.1 52.73,41.3 52.07,40.64 v52.07,38.1 | IC3.6 37.8,40.34 38.1,40.64 45.72,40.64 47.62,38.73 v47.62,38.1 | v46.35,30.48 R7.4
  Bottom 0.152: v52.07,38.1 v47.62,38.1 43.81,34.29 43.81,33.02 v46.35,30.48
DAT3  (via drill 0.33)
  Top 0.152: IC1.50 35.3,36.58 v35.56,36.83 | IC3.9 39.63,44.83 v40.01,44.45
  Bottom 0.152: v35.56,36.83 35.56,40.01 v40.01,44.45
DAT3_A  (via drill 0.33)
  Top 0.152: JP3.2 53.53,14.8 v53.34,14.61 | IC3.11 37.8,43.48 38.73,42.55 v41.27,42.55 | v40.01,26.67 40.01,31.11 v40.64,31.75 | R7.12 v45.09,20.32
  Bottom 0.152: v53.34,14.61 52.7,15.24 52.7,20.32 51.44,21.59 45.72,21.59 | 45.72,21.59 40.64,21.59 40.01,22.23 v40.01,26.67 | v40.64,31.75 40.64,41.91 v41.27,42.55 | v45.09,20.32 45.09,20.95 45.72,21.59
DAT3_B  (via drill 0.33)
  Top 0.152: IC3.10 38.45,43.46 38.73,43.18 43.18,43.18 44.45,41.91 45.72,41.91 v47.62,40.01 | v52.7,40.01 52.9,40.2 JP4.2 | v45.09,30.48 R7.5
  Bottom 0.152: v52.7,40.01 v47.62,40.01 42.55,34.92 42.55,33.02 v45.09,30.48
ERASE
  Top 0.152: IC1.61 28.3,40.27 JP2.2
GND  (via drill 0.33, 3.17 pad 5.08)
  Top 0.254: IC1.6 23.8,20.01 | IC1.7 24.3,20.14 | 24.8,19.99 IC1.8 24.8,22.27 | IC1.10 25.8,19.91 | 25.3,22.77 IC1.9 25.3,20.17
  other vias: 8.26,22.86 53.34,27.94 5.08,33.02 5.08,22.86 21.59,30.48 22.86,26.67 26.67,32.38 33.02,24.77 41.27,24.13 38.1,33.02 38.73,31.11 36.83,26.04 35.56,17.78 45.09,24.77 21.59,23.5 22.23,15.88 43.18,26.67 41.91,37.47 36.2,42.55 31.11,43.18 6.35,27.3 3.17,3.17 53.98,47.62 18.41,47.62 15.24,42.55 29.84,15.24
  pour Bottom (isolate 0.254): 0,0 57.15,0 57.15,50.8 0,50.8
  pour Top (isolate 0.152, rank 2): 0,0 57.15,0 57.15,50.8 0,50.8
LED_ACT  (via drill 0.33)
  Top 0.152: R2.2 16.14,11.06 17.14,12.06 24.13,12.06 v26.67,14.61 | IC1.12 26.8,22.36 v27.3,22.86
  Bottom 0.152: v26.67,14.61 27.3,15.24 v27.3,22.86
LED_ERR  (via drill 0.33)
  Top 0.152: IC1.17 29.3,22.13 v28.57,22.86 | R3.2 19.95,11.06 20.32,11.43 24.77,11.43 v28.57,15.24
  Bottom 0.152: v28.57,22.86 27.94,22.23 27.94,15.88 v28.57,15.24
LED_RDY  (via drill 0.33)
  Top 0.152: R1.2 10.16,11.43 10.79,12.06 15.88,12.06 16.51,12.7 23.5,12.7 v26.04,15.24 | IC1.11 26.3,22.59 v26.04,22.86
  Bottom 0.152: v26.04,15.24 v26.04,22.86
N$1
  Top 0.406: IC4.5 15.19,17.46 L2.1
N$2
  Top 0.406: C11.1 IC5.3 39.54,10.62 38.73,11.43 Q3.3
N$3  (via drill 0.33)
  Top 0.152: C1.1 R11.1 18.05,20.59 v18.41,20.95 | IC1.97 20.9,24.71 v20.95,24.77
  Bottom 0.152: v18.41,20.95 18.41,22.23 v20.95,24.77
N$4
  Top 0.406: C16.1 R10.2 2.54,31.75 1.27,30.48
  pour Top: 0,19.68 2.54,19.68 2.54,20.32 2.54,31.11 0,31.11
N$5
  Top 0.254: R4.2 L1.1
N$6  (via drill 0.35)
  Top 0.254: IC1.4 22.8,23.44 v22.86,23.5
  Top 0.406: R8.1 26.67,17.14 24.13,14.61 v22.86,14.61 22.23,13.97 C13.1
  Bottom 0.406: v22.86,14.61 22.86,15.52 22.92,15.59 22.92,23.43 v22.86,23.5
N$14
  Top 0.152: R3.1 LED3.A
N$15
  Top 0.152: R2.1 LED2.A
N$16
  Top 0.152: R1.1 LED1.A
NRST  (via drill 0.33)
  Top 0.152: R13.1 13.97,48.9 v13.34,49.53 3.81,49.53 3.17,48.9 JP5.10 | IC1.58 29.8,39.97 v32.38,42.55
  Bottom 0.152: v32.38,42.55 32.38,43.18 29.84,45.72 19.68,45.72 19.05,46.35 16.51,46.35 v13.34,49.53
SWCLK  (via drill 0.33, 0.35)
  Top 0.152: v22.23,45.09 24.13,43.18 v24.13,42.55 | IC1.63 v27.3,38.73 | R12.1 v11.43,46.35
  Bottom 0.152: v22.23,45.09 19.68,45.09 19.05,45.72 12.06,45.72 v11.43,46.35 10.16,47.62 3.17,47.62 1.27,45.72 1.27,43.18 2.54,41.91 JP5.4 | v24.13,42.55 26.04,42.55 26.67,41.91 26.67,39.37 v27.3,38.73
SWDIO  (via drill 0.33)
  Top 0.152: IC1.57 30.3,38.56 v32.38,40.64 | R14.1 9.53,43.81 v8.89,44.45 7.62,43.18 v7.62,41.91
  Bottom 0.152: v32.38,40.64 28.57,44.45 19.05,44.45 18.41,45.09 9.53,45.09 v8.89,44.45 | JP5.2 3.17,40.01 3.81,39.37 6.35,39.37 7.62,40.64 v7.62,41.91
TRACESWO  (via drill 0.33)
  Top 0.152: IC1.77 20.74,34.71 v20.95,34.92
  Bottom 0.152: v20.95,34.92 20.95,37.47 18.41,40.01 18.41,43.18 17.78,43.81 13.34,43.81 12.06,42.55 8.26,42.55 6.35,44.45 6.35,46.35 5.71,46.99 3.17,46.99 1.91,45.72 1.91,43.81 2.54,43.18 JP5.6
USB_N
  Top 0.152: JP1.D- 6.35,26.05 7.3,27 D1.6 7.3,26.35 7.62,26.04 8.26,26.04 17.58,26.05 17.74,26.21 IC1.94
USB_P
  Top 0.152: JP1.D+ 6.35,25.4 7.3,24.45 D1.1 7.3,25.09 7.62,25.4 17.36,25.4 17.67,25.71 IC1.95
VDDCORE  (via drill 0.33)
  Top 0.254: C17.1 37.06,29.71 IC1.39 33.52,29.71 33.02,29.21 33.02,26.04 31.11,24.13 | 29.21,24.13 24.13,24.13 v22.23,26.04 | C19.1 32.38,19.68 31.8,20.27 IC1.22 31.8,23.44 31.11,24.13 | 29.21,24.13 31.11,24.13 | 29.21,24.13 29.8,23.54 IC1.18 | C12.1 29.48,19.32 29.8,19.64 IC1.18 | 29.84,21.17 IC1.18 | C18.1 12.33,32.12 12.7,31.75 v12.7,31.11 FB2.1 | IC1.76 19.3,35.94 v19.05,36.2 | FB1.1 v13.34,24.13
  Top 0.406: R8.2 C12.1
  Bottom 0.254: v19.05,36.2 19.05,32.38 17.78,31.11 v12.7,31.11 12.7,24.77 v13.34,24.13 15.24,26.04 v22.23,26.04
VDDPLL
  Top 0.254: IC1.86 18.05,30.21 17.14,31.11 16.51,31.11 | C22.1 16.14,31.48 16.51,31.11 | FB2.2 16.51,31.11
VDDPLLUSB
  Top 0.254: 17.41,27.94 C23.2 | 17.41,27.94 L1.2 | IC1.90 17.68,28.21 17.41,27.94
VDDUTMIC
  Top 0.254: C21.1 16.82,22.27 16.77,22.32 FB1.2 17.14,24.13 18.23,25.21 IC1.96
XIN
  Top 0.152: IC1.99 20.74,23.71 20.95,23.5 20.95,22.86 20.32,22.23 20.32,20.95 20.79,20.49 X1.1 | X1.1 | X1.1 20.61,19.05 20.32,19.05 20.59,19.32 22.23,19.32 C2.1
XOUT
  Top 0.152: IC1.98 18.5,24.21 18.33,24.04 18.33,22.94 18.46,22.81 18.47,22.81 19.68,21.59 19.68,18.41 18.89,17.61 18.61,17.61 | 18.61,17.61 X1.3 | C3.1 18.79,17.43 18.61,17.61

### Text on the board
tNames: ERASE | B | A | Orthrus / v3.0.1 | Geppetto / Electronics